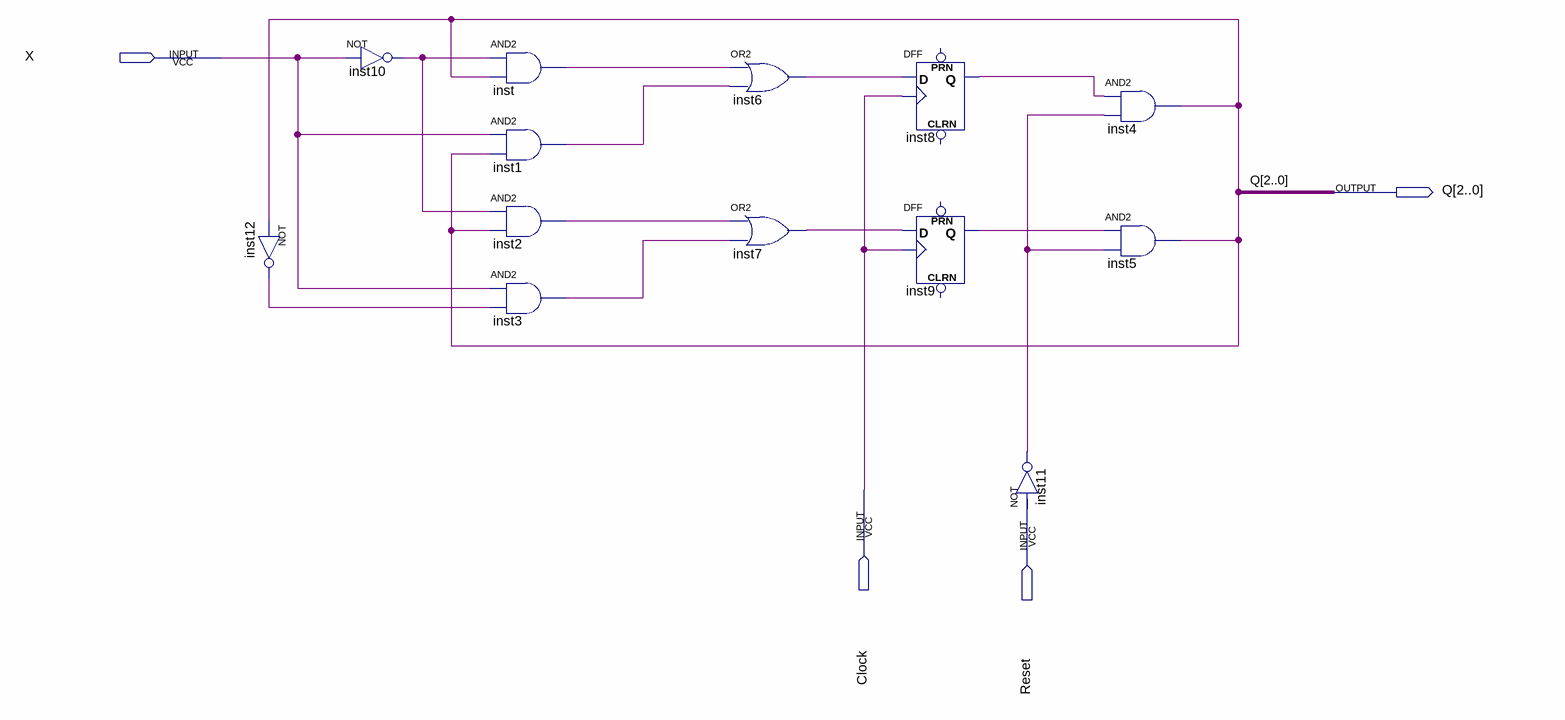
[diagram p0: schematic sheet]
// Quartus schematic MEF.bdf as structural Verilog: 13 symbols, 4 pins
module MEF (
  input  X,
  input  Clock,
  input  Reset,
  output [2:0] Q
);

  wire inst1_out, inst2_out, inst3_out, inst4_out, inst6_out, inst7_out, inst8_q, inst9_q, inst10_out,
       inst11_out, inst12_out, inst_out;

  not inst12 (inst12_out, inst4_out);
  not inst10 (inst10_out, X);
  and inst (inst_out, inst10_out, inst4_out);
  and inst1 (inst1_out, X, inst4_out);
  and inst2 (inst2_out, inst10_out, inst4_out);
  and inst3 (inst3_out, X, inst12_out);
  or inst6 (inst6_out, inst_out, inst1_out);
  or inst7 (inst7_out, inst2_out, inst3_out);
  DFF inst8 (.CLK(Clock), .D(inst6_out), .Q(inst8_q));  // open: CLRN, PRN
  DFF inst9 (.CLK(Clock), .D(inst7_out), .Q(inst9_q));  // open: CLRN, PRN
  not inst11 (inst11_out, Reset);
  and inst4 (inst4_out, inst8_q, inst11_out);
  and inst5 (inst4_out, inst9_q, inst11_out);
endmodule
